# EAGLE schematic dabpi_v1 (EAGLE 6.6.0)
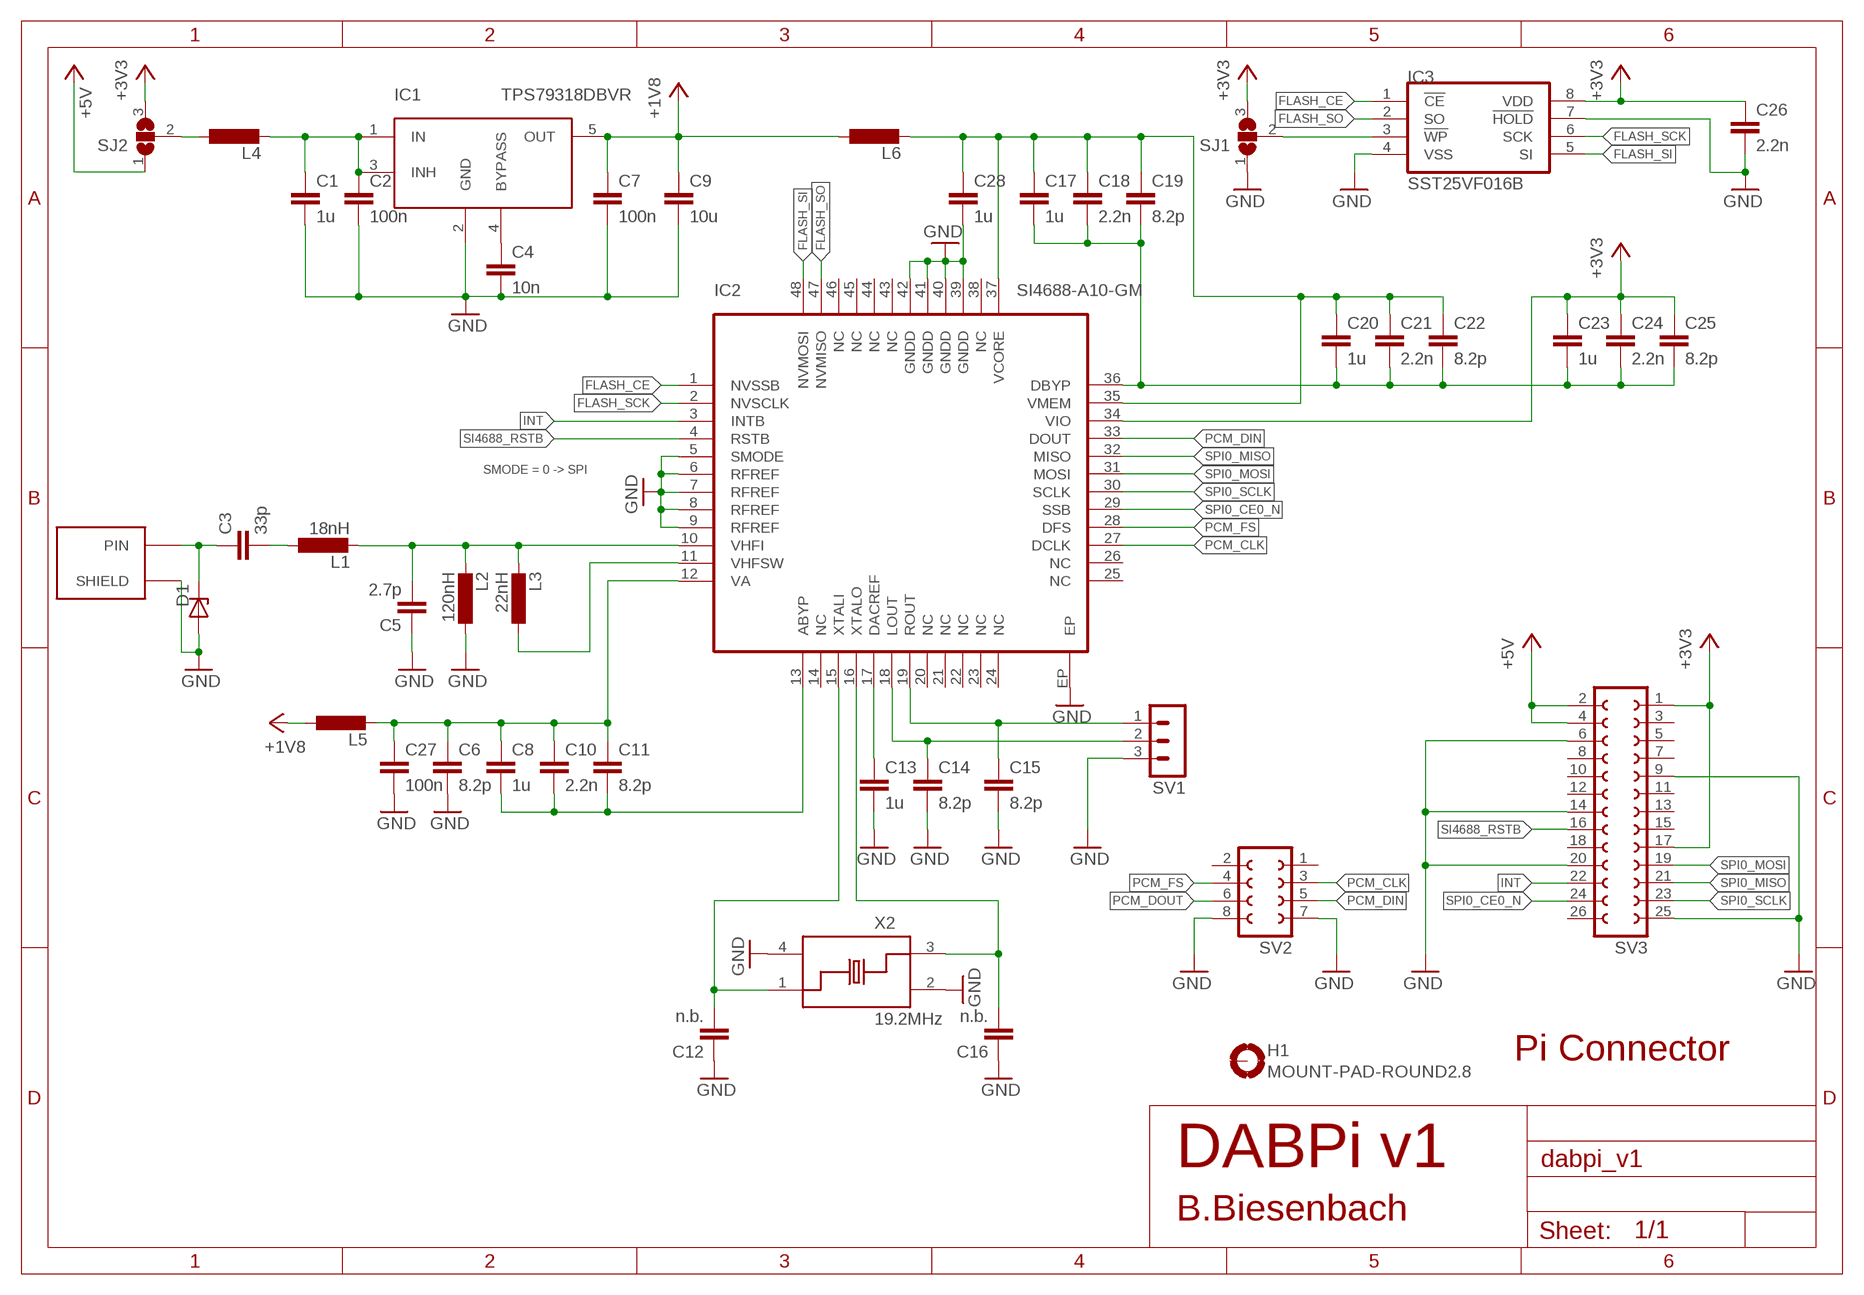
[diagram p0: schematic, sheet 1]

## Parts
C1  1u  C0603  [SMD0603]
C2  100n  C0603  [SMD0603]
C3  33p  C0402  [SMD0402]
C4  10n  C0603  [SMD0603]
C5  2.7p  C0402  [SMD0402]
C6  8.2p  C0603  [SMD0603]
C7  100n  C0603  [SMD0603]
C8  1u  C0603  [SMD0603]
C9  10u  C0603  [SMD0603]
C10  2.2n  C0603  [SMD0603]
C11  8.2p  C0603  [SMD0603]
C12  n.b.  C0402  [SMD0402]
C13  1u  C0603  [SMD0603]
C14  8.2p  C0603  [SMD0603]
C15  8.2p  C0603  [SMD0603]
C16  n.b.  C0402  [SMD0402]
C17  1u  C0603  [SMD0603]
C18  2.2n  C0603  [SMD0603]
C19  8.2p  C0603  [SMD0603]
C20  1u  C0603  [SMD0603]
C21  2.2n  C0603  [SMD0603]
C22  8.2p  C0603  [SMD0603]
C23  1u  C0603  [SMD0603]
C24  2.2n  C0603  [SMD0603]
C25  8.2p  C0603  [SMD0603]
C26  2.2n  C0603  [SMD0603]
C27  100n  C0603  [SMD0603]
C28  1u  C0603  [SMD0603]
D1  ESD9L5.0  [SOD923]
H1  MOUNT-PAD-ROUND2.8  [2,8-PAD]
IC1  TPS79318DBVR  [SOT23-5]
IC2  SI4688-A10-GM  [QFN48]
IC3  SST25VF016B  [SO08]
L1  18nH  L0402  [SMD0402]
L2  120nH  L0402  [SMD0402]
L3  22nH  L0402  [SMD0402]
L4  L0603  [SMD0603]
L5  L0603  [SMD0603]
L6  L0603  [SMD0603]
SJ1  SJ2W  [SJ_2]
SJ2  SJ2W  [SJ_2]
SV1  MA03-1  [MA03-1]
SV2  FE04-2  [FE04-2]
SV3  FE13-2  [FE13-2]
X1  SMA_LP_1.57MM  [SMA_LP_1.57MM]
X2  19.2MHz  XTAL_3.2X2.5  [XTAL_3.2X2.5]

## Nets
+1V8: C7.1 C9.1 IC1.5(OUT) L5.1 L6.1
+3V3: C23.1 C24.1 C25.1 C26.1 IC2.34(VIO) IC3.8(VDD) SJ1.3 SJ2.3 SV3.1 SV3.17
+5V: SJ2.1 SV3.2 SV3.4
FLASH_CE: IC2.1(NVSSB) IC3.1(!CE)
FLASH_SCK: IC2.2(NVSCLK) IC3.6(SCK)
FLASH_SI: IC2.48(NVMOSI) IC3.5(SI)
FLASH_SO: IC2.47(NVMISO) IC3.2(SO)
GND: C1.2 C2.2 C4.2 C5.1 C6.2 C7.2 C9.2 C12.1 C13.2 C14.2 C15.2 C16.1 C26.2 C27.2 C28.2 D1.A IC1.2(GND) IC2.5(SMODE) IC2.6(RFREF) IC2.7(RFREF) IC2.8(RFREF) IC2.9(RFREF) IC2.39(GNDD) IC2.40(GNDD) IC2.41(GNDD) IC2.42(GNDD) IC2.EP IC3.4(VSS) IC3.7(!HOLD) L2.1 SJ1.1 SV1.3 SV2.7 SV2.8 SV3.6 SV3.9 SV3.14 SV3.20 SV3.25 X1.GND(SHIELD) X1.GND@1(SHIELD) X1.GND@2(SHIELD) X1.GND@3(SHIELD) X2.2(GND) X2.4(GND)
INT: IC2.3(INTB) SV3.22
LDO_IN: C1.1 C2.1 IC1.1(IN) IC1.3(INH) L4.2
N$1: C3.2 L1.1
N$2: C5.2 IC2.10(VHFI) L1.2 L2.2 L3.2
N$3: IC2.11(VHFSW) L3.1
N$4: C8.2 C10.2 C11.2 IC2.13(ABYP)
N$5: C17.2 C18.2 C19.2 C20.2 C21.2 C22.2 C23.2 C24.2 C25.2 IC2.36(DBYP)
N$6: C12.2 IC2.15(XTALI) X2.1
N$7: C16.2 IC2.16(XTALO) X2.3
N$8: C13.1 IC2.17(DACREF)
N$9: IC3.3(!WP) SJ1.2
N$10: L4.1 SJ2.2
N$11: C4.1 IC1.4(BYPASS)
N$12: C6.1 C8.1 C10.1 C11.1 C27.1 IC2.12(VA) L5.2
N$14: C17.1 C18.1 C19.1 C20.1 C21.1 C22.1 C28.1 IC2.35(VMEM) IC2.37(VCORE) L6.2
PCM_CLK: IC2.27(DCLK) SV2.3
PCM_DIN: IC2.33(DOUT) SV2.5
PCM_DOUT: SV2.6
PCM_FS: IC2.28(DFS) SV2.4
RF_IN: C3.1 D1.K(C) X1.PIN
SI4688_LOUT: C14.1 IC2.18(LOUT) SV1.2
SI4688_ROUT: C15.1 IC2.19(ROUT) SV1.1
SI4688_RSTB: IC2.4(RSTB) SV3.16
SPI0_CE0_N: IC2.29(SSB) SV3.24
SPI0_MISO: IC2.32(MISO) SV3.21
SPI0_MOSI: IC2.31(MOSI) SV3.19
SPI0_SCLK: IC2.30(SCLK) SV3.23
Unconnected: H1.B2,8(MOUNT) IC2.14(NC) IC2.20(NC) IC2.21(NC) IC2.22(NC) IC2.23(NC) IC2.24(NC) IC2.25(NC) IC2.26(NC) IC2.38(NC) IC2.43(NC) IC2.44(NC) IC2.45(NC) IC2.46(NC) SV2.1 SV2.2 SV3.3 SV3.5 SV3.7 SV3.8 SV3.10 SV3.11 SV3.12 SV3.13 SV3.15 SV3.18 SV3.26

## Notes on the sheet
- SMODE = 0 -> SPI
- Pi Connector
- DABPi v1
- B.Biesenbach

## Library data of the parts
C1 C2 C4 C6-C11 C13-C15 C17-C28 = generisch:C0603
C3 C5 C12 C16 = generisch:C0402
D1 = generisch:ESD9L5.0
H1 = holes:MOUNT-PAD-ROUND: MOUNTING PAD, round
IC1 = ldo_reg:TPS79318DBVR
IC2 = SI4688-A10-GM:SI4688-A10-GM
IC3 = sst25:SST25VF016B
L1-L3 = generisch:L0402
L4-L6 = generisch:L0603
SJ1 SJ2 = jumper:SJ2W: SMD solder JUMPER
SV1 = con-lstb:MA03-1: PIN HEADER; OC_FARNELL: unknown; OC_NEWARK: unknown
SV2 = generisch:FE04-2: FEMALE HEADER; OC_FARNELL: unknown; OC_NEWARK: unknown
SV3 = con-lsta:FE13-2: FEMALE HEADER; OC_FARNELL: unknown; OC_NEWARK: unknown
X1 = con_sma:SMA_LP_1.57MM: Abschlussbuchse SMA LP rund 1,57mm RS 526-5785
X2 = generisch:XTAL_3.2X2.5